# EAGLE design Twelve_to_Five_Volt_Converter (EAGLE 6.2)
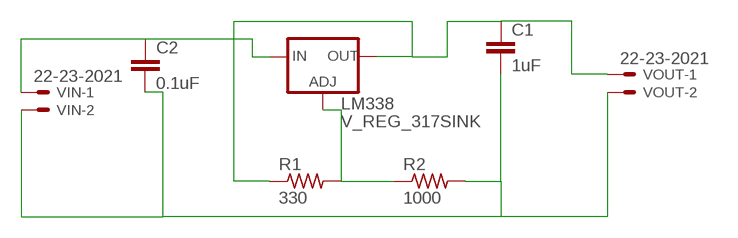
[diagram p0: schematic, sheet 1]

## Parts
C1  1uF  C5/3.5  [C5B3.5]
C2  0.1uF  C5/3.5  [C5B3.5]
LM338  V_REG_317SINK  [TO220-ADJ]
R1  330  R-US_0207/10  [0207/10]
R2  1000  R-US_0207/10  [0207/10]
VIN  22-23-2021  [22-23-2021]
VOUT  22-23-2021  [22-23-2021]

## Nets
GND: C1.2 C2.2 R2.2 VIN.2 VOUT.2
N$1: LM338.ADJ R1.2 R2.1
N$2: C1.1 LM338.OUT R1.1 VOUT.1
N$4: C2.1 LM338.IN VIN.1

## Library data of the parts
C1 C2 = capacitor-wima:C: CAPACITOR naming: grid - package width
LM338 = SparkFun:V_REG_317: Voltage Regulator Standard LM317 adjustable voltage regulator. AOI (Adjust Output Input). Google 'LM317 Calculator' for easy to use app to get the two resistor values needed. 240/720 for 5V output. 240/390 for 3.3V output. Spark Fun Electronics SKU : COM-00527
R1 R2 = resistor:R-US_: RESISTOR, American symbol
VIN VOUT = con-molex:22-23-2021: .100" (2.54mm) Center Header - 2 Pin; MF: MOLEX; MPN: 22-23-2021; OC_FARNELL: 1462926; OC_NEWARK: 25C3832

## Board
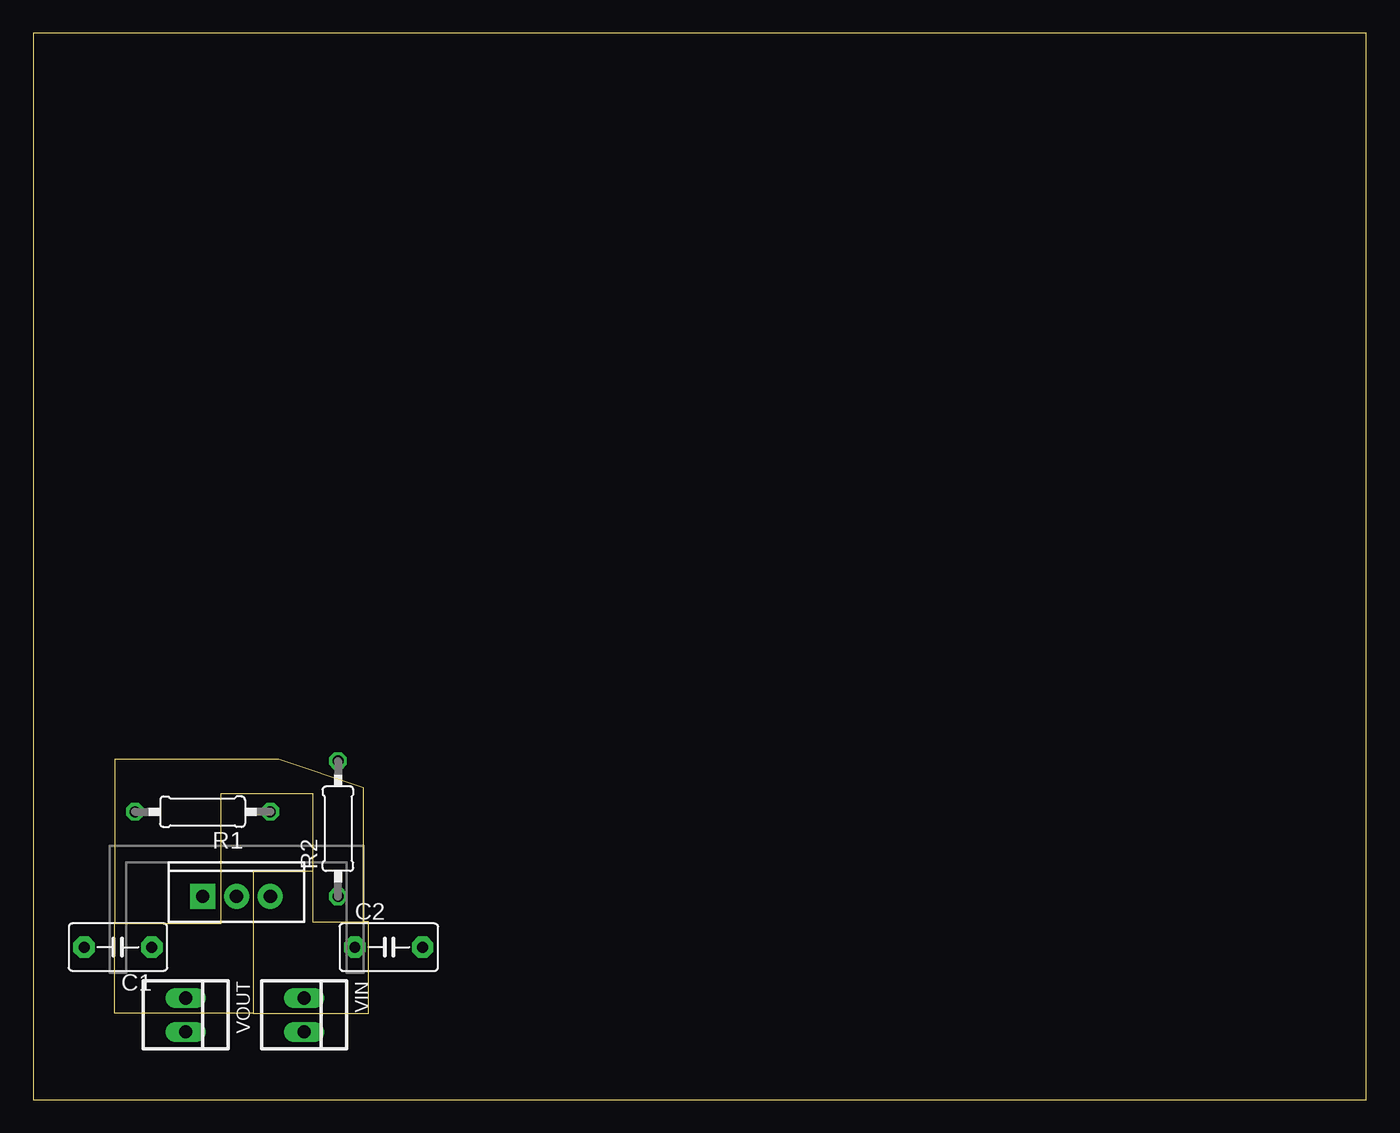
[diagram p1: board, top side]
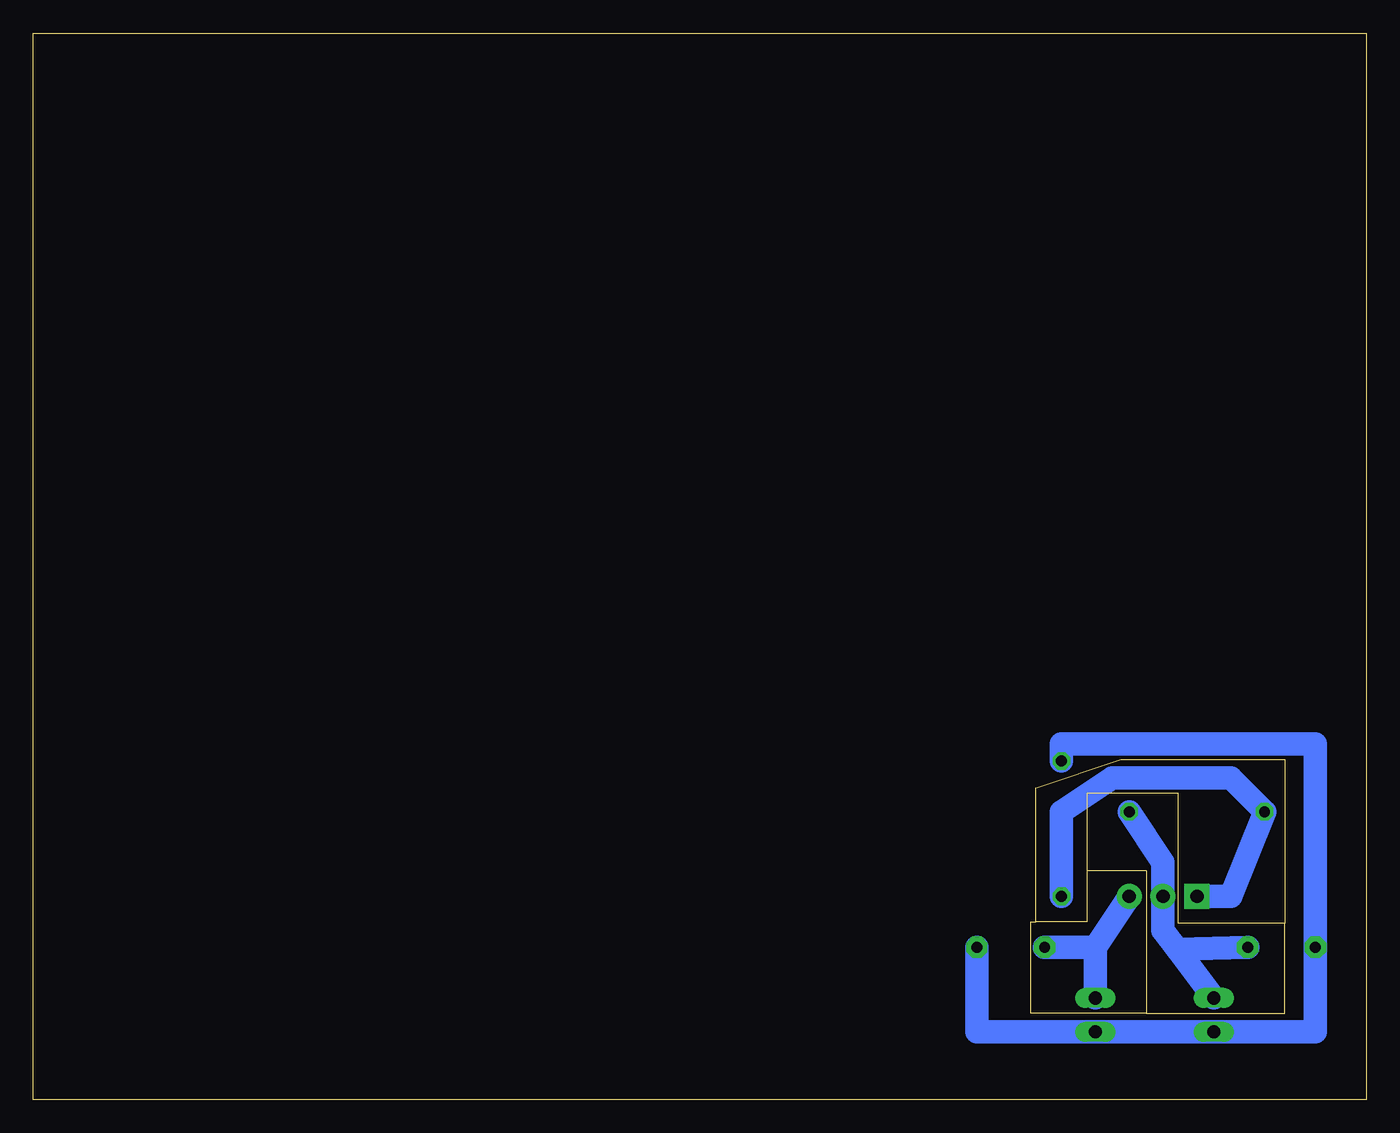
[diagram p2: board, bottom side, seen from below]

Size 100 x 80 mm. Coordinates in mm from the lower left corner, seen from the top.
Outline: 0,0 100,0 100,80 0,80 0,0
Copper layers (1*16): Top 0.035mm / dielectric 1.5mm / Bottom 0.035mm
Design rules: minimum track width 10mil, minimum drill 24mil, track to track 8mil, track to pad 8mil, pad to pad 8mil, via to via 8mil, smd to smd 8mil, copper to edge 40mil, drill to drill 8mil, minimum pad ring 10mil, minimum via ring 8mil, stop-mask expansion 4mil, vias tented up to drill 0mil, thermal gap 10mil
Milling: 17 lines

### Footprints (pad centres in the part's own frame; a part is rotated, then mirrored left to right if it is on the bottom)
C5B3.5 = drill 0.813 pad 1.6 octagon: 1 -2.54,0; 2 2.54,0
TO220-ADJ = drill 1 pad 1.88 square: ADJ -2.54,0 | drill 1 pad 1.88: IN 2.54,0; OUT 0,0
0207/10 = drill 0.813 octagon: 1 -5.08,0; 2 5.08,0
22-23-2021 = drill 1 long: 1 -1.27,0; 2 1.27,0

### Placement (x,y rotation side)
C1  6.35,11.43 180 top
C2  26.67,11.43 0 top
LM338  15.24,15.24 0 top
R1  12.7,21.59 180 top
R2  22.86,20.32 90 top
VIN  20.32,6.35 270 top
VOUT  11.43,6.35 270 top

### Tracks (layer width: path | path; a pad name or v marks a point on that pad's centre or on a via)
GND
  Bottom 1.778: C2.2 29.21,5.08 VIN.2 VOUT.2 3.81,5.08 C1.2 3.81,26.67 22.86,26.67 R2.2
N$1
  Bottom 1.778: LM338.ADJ 10.16,15.24 R1.2 10.16,24.13 19.05,24.13 22.86,21.59 R2.1
N$2
  Bottom 1.778: VOUT.1 14.17,11.28 | 14.17,11.28 15.24,12.7 LM338.OUT 15.24,17.78 R1.1 | C1.1 14.17,11.28
N$4
  Bottom 1.778: VIN.1 20.32,11.43 | 20.32,11.43 LM338.IN | C2.1 20.32,11.43